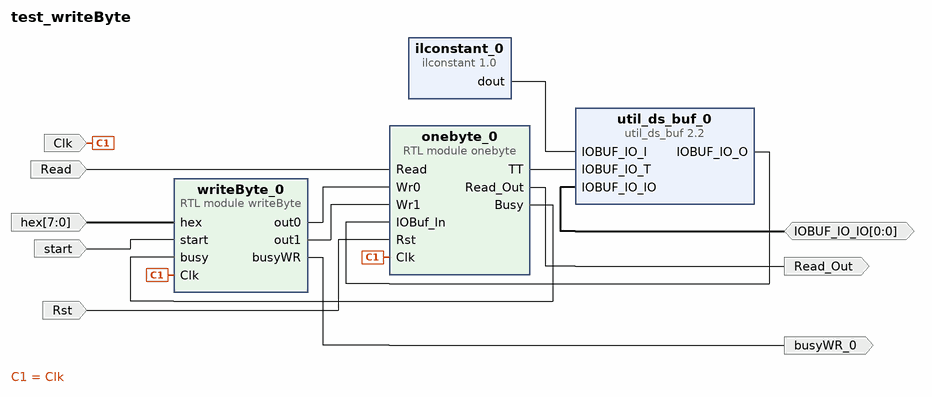
[diagram p0: block diagram of the top level]
# Vivado block design test_writeByte, xczu3eg-sfvc784-2-e, Vivado 2025.1
create_bd_design test_writeByte

create_bd_port -dir I Clk
create_bd_port -dir I -from 7 -to 0 hex
create_bd_port -dir I start
create_bd_port -dir O Read_Out
create_bd_port -dir I Read
create_bd_port -dir I Rst
create_bd_port -dir O busyWR_0
create_bd_port -dir IO -from 0 -to 0 IOBUF_IO_IO

create_bd_cell -type module -reference writeByte writeByte_0
create_bd_cell -type module -reference onebyte onebyte_0
create_bd_cell -type ip -vlnv xilinx.com:ip:util_ds_buf:2.2 util_ds_buf_0
set_property -dict {CONFIG.C_BUF_TYPE IOBUF} [get_bd_cells util_ds_buf_0]
create_bd_cell -type inline_hdl -vlnv xilinx.com:inline_hdl:ilconstant:1.0 ilconstant_0

# ---- connections ----

connect_bd_net [get_bd_ports Clk] [get_bd_pins writeByte_0/Clk] [get_bd_pins onebyte_0/Clk]
connect_bd_net [get_bd_ports IOBUF_IO_IO] [get_bd_pins util_ds_buf_0/IOBUF_IO_IO]
connect_bd_net [get_bd_ports Read] [get_bd_pins onebyte_0/Read]
connect_bd_net [get_bd_ports Rst] [get_bd_pins onebyte_0/Rst]
connect_bd_net [get_bd_ports hex] [get_bd_pins writeByte_0/hex]
connect_bd_net [get_bd_pins ilconstant_0/dout] [get_bd_pins util_ds_buf_0/IOBUF_IO_I]
connect_bd_net [get_bd_pins onebyte_0/Busy] [get_bd_pins writeByte_0/busy]
connect_bd_net [get_bd_pins onebyte_0/Read_Out] [get_bd_ports Read_Out]
connect_bd_net [get_bd_pins onebyte_0/TT] [get_bd_pins util_ds_buf_0/IOBUF_IO_T]
connect_bd_net [get_bd_ports start] [get_bd_pins writeByte_0/start]
connect_bd_net [get_bd_pins util_ds_buf_0/IOBUF_IO_O] [get_bd_pins onebyte_0/IOBuf_In]
connect_bd_net [get_bd_pins writeByte_0/busyWR] [get_bd_ports busyWR_0]
connect_bd_net [get_bd_pins writeByte_0/out0] [get_bd_pins onebyte_0/Wr0]
connect_bd_net [get_bd_pins writeByte_0/out1] [get_bd_pins onebyte_0/Wr1]

validate_bd_design
save_bd_design
